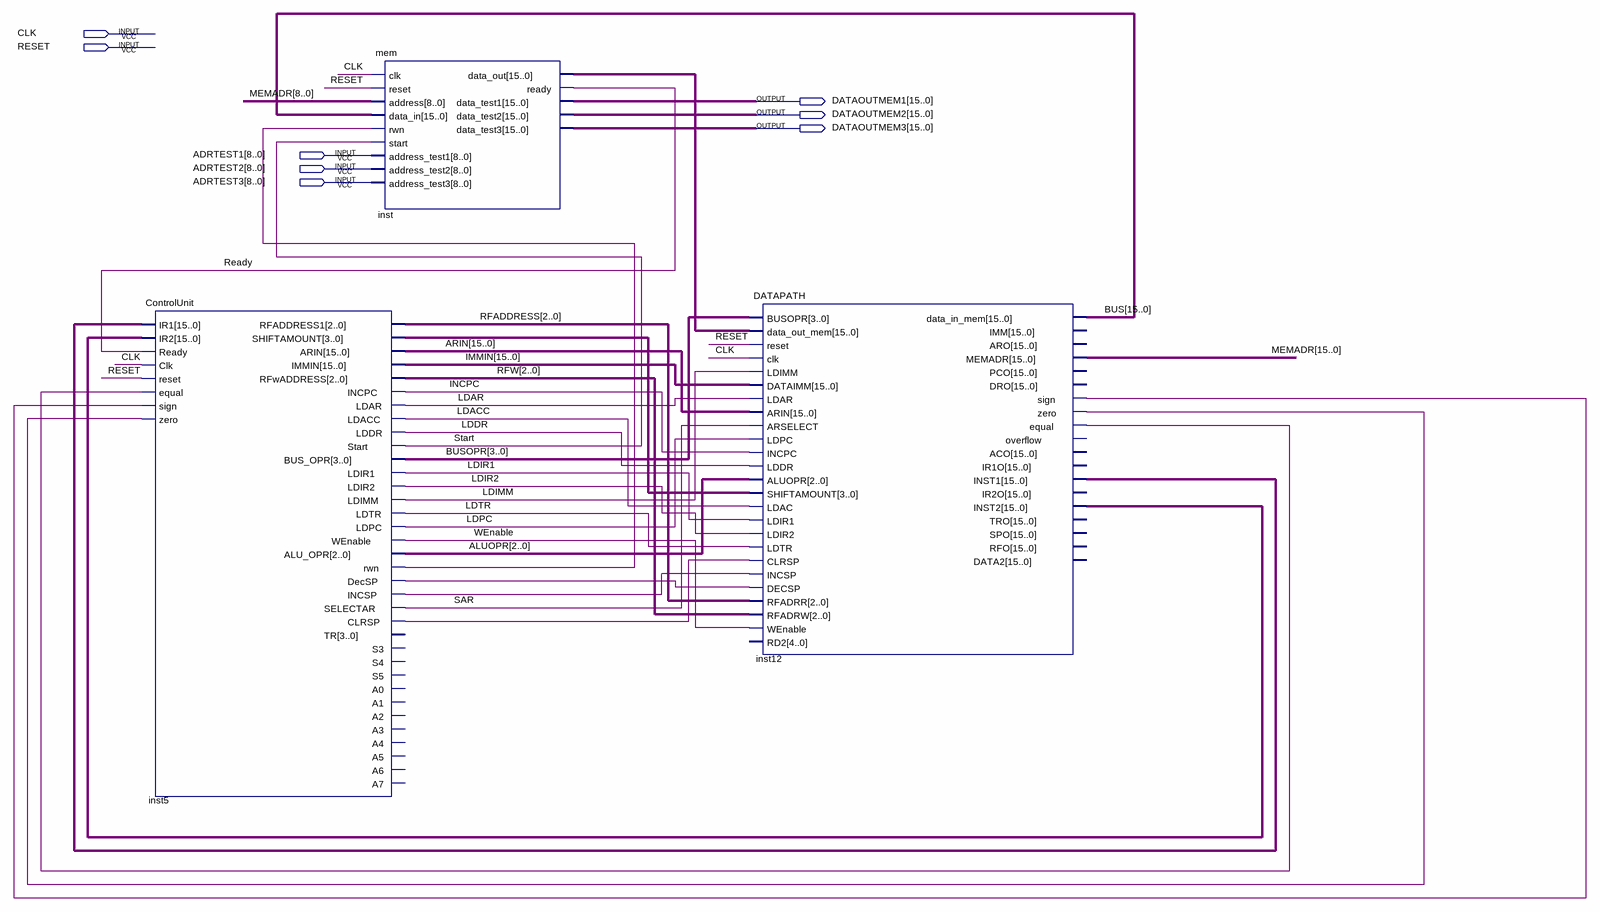
[diagram p0: schematic sheet]
// Quartus schematic CPU_lessdetail.bdf as structural Verilog: 3 symbols, 8 pins
module CPU_lessdetail (
  input  CLK,
  input  RESET,
  input  [8:0] ADRTEST1,
  input  [8:0] ADRTEST2,
  input  [8:0] ADRTEST3,
  output [15:0] DATAOUTMEM1,
  output [15:0] DATAOUTMEM2,
  output [15:0] DATAOUTMEM3
);

  wire INCPC, inst5_clrsp, inst5_decsp, inst5_incsp, inst5_rwn, inst12_equal, inst12_sign, inst12_zero,
       LDACC, LDAR, LDDR, LDIMM, LDIR1, LDIR2, LDPC, LDTR, Ready, SAR, Start, WEnable;
  wire [2:0] ALUOPR, RFADDRESS, RFW;
  wire [3:0] BUSOPR, inst5_shiftamount;
  wire [15:0] ARIN, BUS, IMMIN, inst12_inst1, inst12_inst2, inst_data_out, MEMADR;

  ControlUnit inst5 (
    .IR1(inst12_inst1), .IR2(inst12_inst2), .Ready(Ready), .Clk(CLK), .reset(RESET), .equal(inst12_equal),
    .sign(inst12_sign), .zero(inst12_zero), .RFADDRESS1(RFADDRESS), .SHIFTAMOUNT(inst5_shiftamount),
    .ARIN(ARIN), .IMMIN(IMMIN), .RFwADDRESS(RFW), .INCPC(INCPC), .LDAR(LDAR), .LDACC(LDACC), .LDDR(LDDR),
    .Start(Start), .BUS_OPR(BUSOPR), .LDIR1(LDIR1), .LDIR2(LDIR2), .LDIMM(LDIMM), .LDTR(LDTR), .LDPC(LDPC),
    .WEnable(WEnable), .ALU_OPR(ALUOPR), .rwn(inst5_rwn), .DecSP(inst5_decsp), .INCSP(inst5_incsp),
    .SELECTAR(SAR), .CLRSP(inst5_clrsp));  // open: TR, S3, S4, S5, A0, A1, A2, A3, A4, A5, A6, A7
  mem inst (
    .clk(CLK), .reset(RESET), .address(MEMADR[8:0]), .data_in(BUS), .rwn(inst5_rwn), .start(Start),
    .address_test1(ADRTEST1), .address_test2(ADRTEST2), .address_test3(ADRTEST3), .data_out(inst_data_out),
    .ready(Ready), .data_test1(DATAOUTMEM1), .data_test2(DATAOUTMEM2), .data_test3(DATAOUTMEM3));
  DATAPATH inst12 (
    .BUSOPR(BUSOPR), .data_out_mem(inst_data_out), .reset(RESET), .clk(CLK), .LDIMM(LDIMM), .DATAIMM(IMMIN),
    .LDAR(LDAR), .ARIN(ARIN), .ARSELECT(SAR), .LDPC(LDPC), .INCPC(INCPC), .LDDR(LDDR), .ALUOPR(ALUOPR),
    .SHIFTAMOUNT(inst5_shiftamount), .LDAC(LDACC), .LDIR1(LDIR1), .LDIR2(LDIR2), .LDTR(LDTR),
    .CLRSP(inst5_clrsp), .INCSP(inst5_incsp), .DECSP(inst5_decsp), .RFADRR(RFADDRESS), .RFADRW(RFW),
    .WEnable(WEnable), .data_in_mem(BUS), .MEMADR(MEMADR), .sign(inst12_sign), .zero(inst12_zero),
    .equal(inst12_equal), .INST1(inst12_inst1), .INST2(inst12_inst2));  // open: RD2, IMM, ARO, PCO, DRO, overflow, ACO, IR1O, IR2O, TRO, SPO, RFO, DATA2
endmodule
